# Altium project prjChaves.PrjPcb
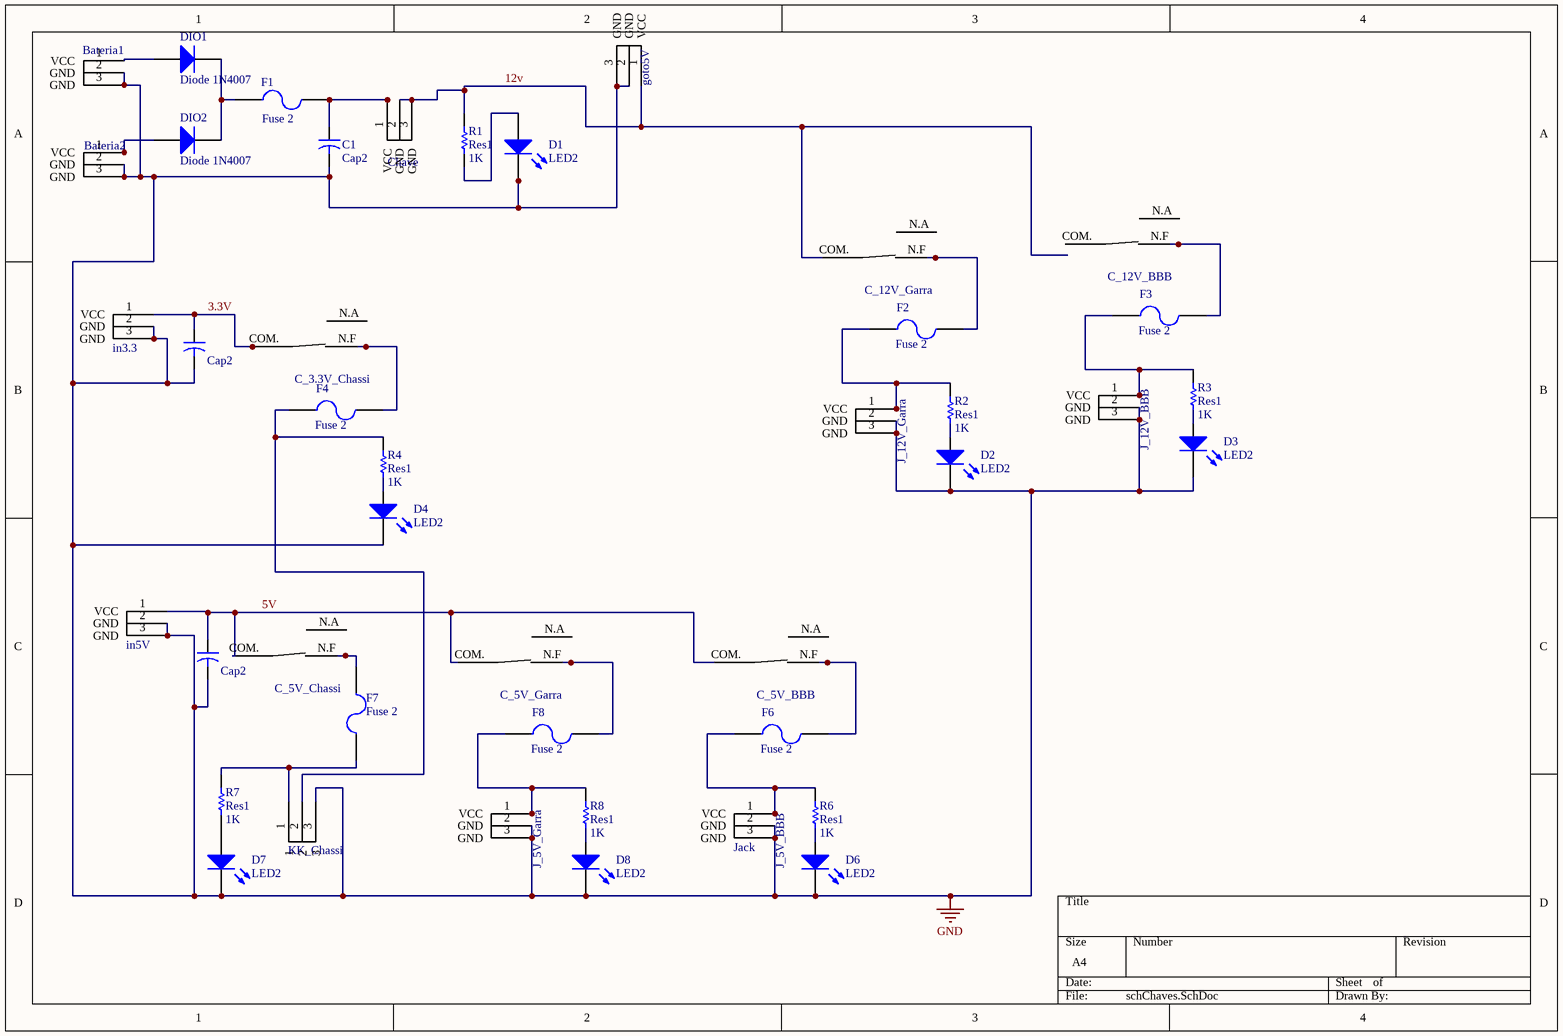
[diagram p0: schChaves.SchDoc]
1 sheet, 43 parts. Net scope: global (net labels, ports and power ports of the same name join across sheets).
Board file: pcbChaves.PcbDoc

## Sheet schChaves.SchDoc
size A4

### Parts
Bateria1  Jack  [JACK J4]  (value not drawn)
Bateria2  Jack  [JACK J4]  (value not drawn)
C1  Cap2  [RAD-0.2]
C3  Cap2  [RAD-0.2]
C5  Cap2  [RAD-0.2]
C_3.3V_Chassi  Chave  [Chave]  (value not drawn)
C_5V_BBB  Chave  [Chave]  (value not drawn)
C_5V_Chassi  Chave  [Chave]  (value not drawn)
C_5V_Garra  Chave  [Chave]  (value not drawn)
C_12V_BBB  Chave  [Chave]  (value not drawn)
C_12V_Garra  Chave  [Chave]  (value not drawn)
Chave  Jack  [JACK J4]  (value not drawn)
D1  LED2  [3.2X1.6X1.1]
D2  LED2  [3.2X1.6X1.1]
D3  LED2  [3.2X1.6X1.1]
D4  LED2  [3.2X1.6X1.1]
D6  LED2  [3.2X1.6X1.1]
D7  LED2  [3.2X1.6X1.1]
D8  LED2  [3.2X1.6X1.1]
DIO1  Diode 1N4007  [DO-41]
DIO2  Diode 1N4007  [DO-41]
F1  Fuse 2  [Fusivel]
F2  Fuse 2  [Fusivel]
F3  Fuse 2  [Fusivel]
F4  Fuse 2  [Fusivel]
F6  Fuse 2  [Fusivel]
F7  Fuse 2  [Fusivel]
F8  Fuse 2  [Fusivel]
goto5V  Jack  [JACK J4]  (value not drawn)
in3.3  Jack  [JACK J4]  (value not drawn)
in5V  Jack  [JACK J4]  (value not drawn)
J_5V_BBB  Jack  [JACK J4]
J_5V_Garra  Jack  [JACK J4]  (value not drawn)
J_12V_BBB  Jack  [JACK J4]  (value not drawn)
J_12V_Garra  Jack  [JACK J4]  (value not drawn)
KK_Chassi  KK3  [3-vias]  (value not drawn)
R1  Res1  value 1K  [AXIAL-0.3]
R2  Res1  value 1K  [AXIAL-0.3]
R3  Res1  value 1K  [AXIAL-0.3]
R4  Res1  value 1K  [AXIAL-0.3]
R6  Res1  value 1K  [AXIAL-0.3]
R7  Res1  value 1K  [AXIAL-0.3]
R8  Res1  value 1K  [AXIAL-0.3]

### Nets
GND: Bateria1.2(GND) Bateria1.3(GND) Bateria2.2(GND) Bateria2.3(GND) C1.2 C3.2 C5.2 D1.2(K) D2.2(K) D3.2(K) D4.2(K) D6.2(K) D7.2(K) D8.2(K) goto5V.2(GND) goto5V.3(GND) in3.3.2(GND) in3.3.3(GND) in5V.2(GND) in5V.3(GND) J_5V_BBB.2(GND) J_5V_BBB.3(GND) J_5V_Garra.2(GND) J_5V_Garra.3(GND) J_12V_BBB.2(GND) J_12V_BBB.3(GND) J_12V_Garra.2(GND) J_12V_Garra.3(GND) KK_Chassi.3
3.3V: C3.1 C_3.3V_Chassi.COM.(COM) in3.3.1(VCC)
5V: C5.1 C_5V_BBB.COM.(COM) C_5V_Chassi.COM.(COM) C_5V_Garra.COM.(COM) in5V.1(VCC)
12v: C_12V_Garra.COM.(COM) Chave.2(GND) Chave.3(GND) goto5V.1(VCC) R1.2
NetBateria1_1: Bateria1.1(VCC) DIO1.1(A)
NetBateria2_1: Bateria2.1(VCC) DIO2.1(A)
NetC1_1: C1.1 Chave.1(VCC) F1.2
NetC_3.3V_Chassi_N.F: C_3.3V_Chassi.N.F F4.2
NetC_5V_BBB_N.F: C_5V_BBB.N.F F6.2
NetC_5V_Chassi_N.F: C_5V_Chassi.N.F F7.1
NetC_5V_Garra_N.F: C_5V_Garra.N.F F8.2
NetC_12V_BBB_N.F: C_12V_BBB.N.F F3.2
NetC_12V_Garra_N.F: C_12V_Garra.N.F F2.2
NetD1_1: D1.1(A) R1.1
NetD2_1: D2.1(A) R2.1
NetD3_1: D3.1(A) R3.1
NetD4_1: D4.1(A) R4.1
NetD6_1: D6.1(A) R6.1
NetD7_1: D7.1(A) R7.1
NetD8_1: D8.1(A) R8.1
NetDIO1_2: DIO1.2(K) DIO2.2(K) F1.1
NetF2_1: F2.1 J_12V_Garra.1(VCC) R2.2
NetF3_1: F3.1 J_12V_BBB.1(VCC) R3.2
NetF4_1: F4.1 KK_Chassi.2 R4.2
NetF6_1: F6.1 J_5V_BBB.1(VCC) R6.2
NetF7_2: F7.2 KK_Chassi.1 R7.2
NetF8_1: F8.1 J_5V_Garra.1(VCC) R8.2

Not connected (* = marked no-connect by the designer): C_3.3V_Chassi N.A; C_5V_BBB N.A; C_5V_Chassi N.A; C_5V_Garra N.A; C_12V_BBB COM.(COM) N.A; C_12V_Garra N.A

### Library data of the parts
C1 C3 C5 = Cap2: Capacitor; Value: 100pF; Published: 23-Sep-2002; PackageReference: CAPR5-4X5; Publisher: Altium Limited; PackageDescription: Capacitor; 2 Leads
C_3.3V_Chassi C_5V_BBB C_5V_Chassi C_5V_Garra C_12V_BBB C_12V_Garra = Chave: pin to pad: COM.>1 N.A>2 N.F>3
D1-D4 D6-D8 = LED2: Typical RED, GREEN, YELLOW, AMBER GaAs LED; Published: 8-Jun-2000; LatestRevisionDate: 17-Jul-2002; LatestRevisionNote: Re-released for DXP Platform.; PackageVersion: Feb-2002; PackageReference: 3.2X1.6X1.1; Publisher: Altium Limited; PackageDescription: SM LED; 2 Flat Leads
DIO1 DIO2 = Diode 1N4007: 1 Amp General Purpose Rectifier; Published: 8-Jun-2000; LatestRevisionDate: 17-Jul-2002; LatestRevisionNote: Re-released for DXP Platform.; DatasheetVersion: 1998; PackageVersion: Aug-1999; PackageReference: DO-41; Publisher: Altium Limited; PackageDescription: Diode, Axial; Body 5.2 x 2.7 mm (LxDia. max), Lead Dia. 0.86 mm (max); Code_JEDEC: DO-204-AL; ComponentLink1Description: Manufacturer Link; ComponentLink1URL: http://www.fairchildsemi.com/; ComponentLink2Description: Datasheet; ComponentLink2URL: http://www.fairchildsemi.com/ds/1N%2F1N4001.pdf
F1-F4 F6-F8 = Fuse 2: Fuse; Published: 8-Jun-2000; LatestRevisionDate: 17-Jul-2002; LatestRevisionNote: Re-released for DXP Platform.; PackageReference: PIN-W2/E2.8; Publisher: Altium Limited; PackageDescription: Thru-Hole; 2 Leads
KK_Chassi = KK3Vias
R1-R4 R6-R8 = Res1: Resistor; Published: 8-Jun-2000; LatestRevisionDate: 17-Jul-2002; LatestRevisionNote: Re-released for DXP Platform.; PackageReference: AXIAL-0.3; Publisher: Altium Limited; PackageDescription: Axial Device, Thru-Hole; 2 Leads; 0.3 in Pin Spacing